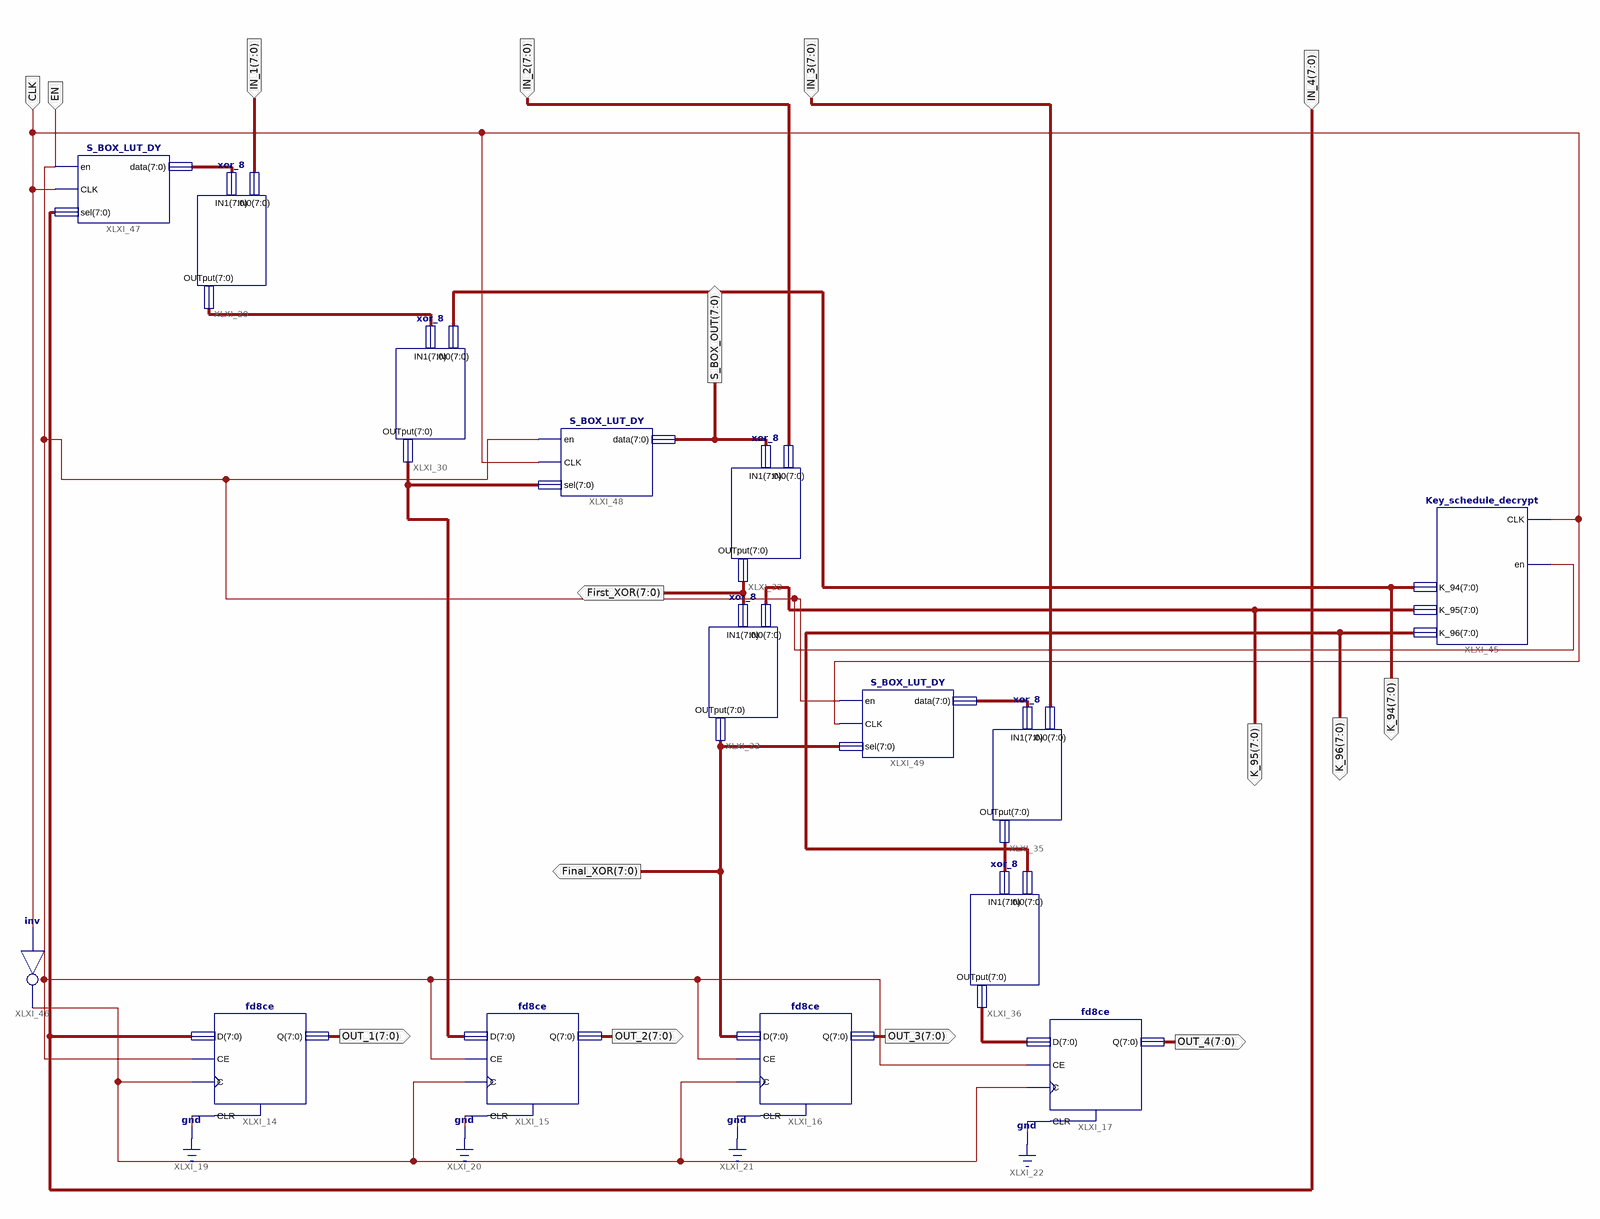
[diagram p0: schematic sheet 1]
// Xilinx ISE schematic Decrypt.sch (spartan3e) as structural Verilog: 15 symbols, 16 ports
module Decrypt (
  input  [7:0] IN_4,
  input  [7:0] IN_1,
  input  [7:0] IN_2,
  input  [7:0] IN_3,
  input  EN,
  input  CLK,
  output [7:0] S_BOX_OUT,
  output [7:0] First_XOR,
  output [7:0] Final_XOR,
  output [7:0] OUT_1,
  output [7:0] OUT_2,
  output [7:0] OUT_3,
  output [7:0] OUT_4,
  output [7:0] K_96,
  output [7:0] K_95,
  output [7:0] K_94
);

  wire XLXN_129;
  wire [7:0] Final_XOR_1, First_XOR_1, S_BOX_OUT_1, XLXN_65, XLXN_68, XLXN_123;

  xor_8 XLXI_29 (.IN0(IN_1), .IN1(S_BOX_OUT_1), .OUTput(First_XOR_1));
  xor_8 XLXI_30 (.IN0(K_94), .IN1(First_XOR_1), .OUTput(Final_XOR_1));
  xor_8 XLXI_32 (.IN0(IN_2), .IN1(S_BOX_OUT), .OUTput(First_XOR));
  xor_8 XLXI_33 (.IN0(K_95), .IN1(First_XOR), .OUTput(Final_XOR));
  xor_8 XLXI_35 (.IN0(IN_3), .IN1(XLXN_65), .OUTput(XLXN_68));
  xor_8 XLXI_36 (.IN0(K_96), .IN1(XLXN_68), .OUTput(XLXN_123));
  fd8ce XLXI_14 (.C(XLXN_129), .CE(EN), .CLR(1'b0), .D(IN_4), .Q(OUT_1));
  fd8ce XLXI_15 (.C(XLXN_129), .CE(EN), .CLR(1'b0), .D(Final_XOR_1), .Q(OUT_2));
  fd8ce XLXI_16 (.C(XLXN_129), .CE(EN), .CLR(1'b0), .D(Final_XOR), .Q(OUT_3));
  fd8ce XLXI_17 (.C(XLXN_129), .CE(EN), .CLR(1'b0), .D(XLXN_123), .Q(OUT_4));
  Key_schedule_decrypt XLXI_45 (.CLK(CLK), .en(EN), .K_94(K_94), .K_95(K_95), .K_96(K_96));
  not XLXI_46 (XLXN_129, CLK);
  S_BOX_LUT_DY XLXI_47 (.en(EN), .CLK(CLK), .sel(IN_4), .data(S_BOX_OUT_1));
  S_BOX_LUT_DY XLXI_48 (.en(EN), .CLK(CLK), .sel(Final_XOR_1), .data(S_BOX_OUT));
  S_BOX_LUT_DY XLXI_49 (.en(EN), .CLK(CLK), .sel(Final_XOR), .data(XLXN_65));
endmodule
